# Altium schematic sheet enc28j60.SchDoc: ENC28J60
size A3
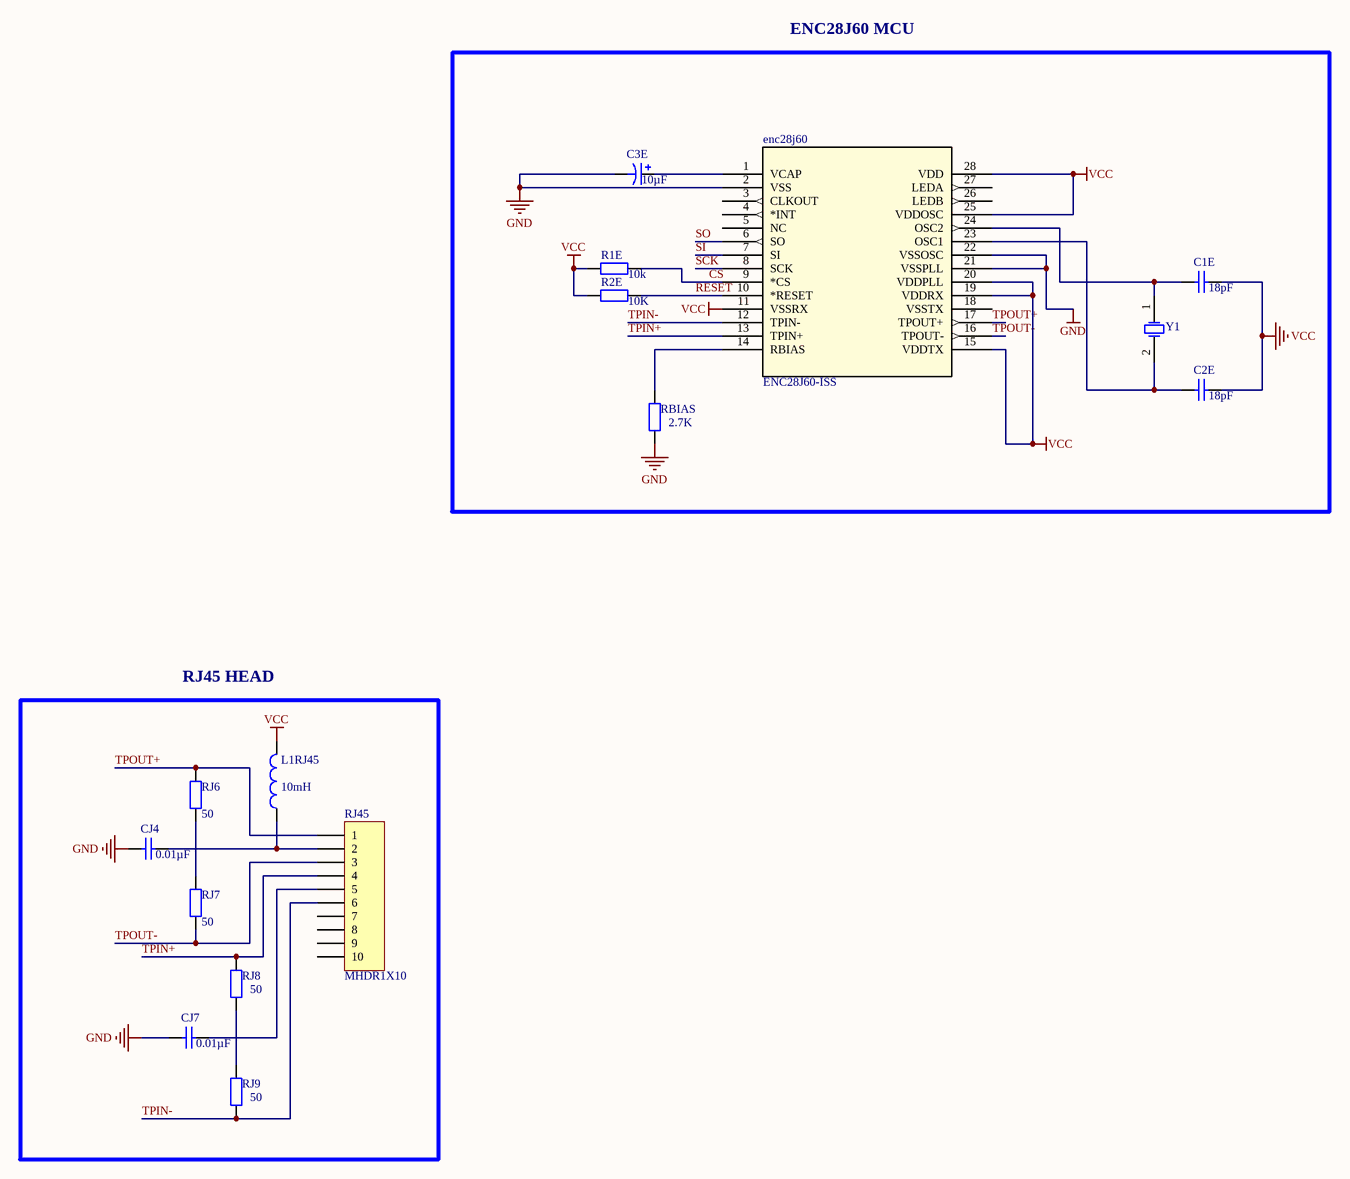
[diagram p0: enc28j60.SchDoc]

## Parts
C1E  value 18pF  [RAD-0.3]  (hidden comment: Cap)
C2E  value 18pF  [RAD-0.3]  (hidden comment: Cap)
C3E  value 10µF  [RB7.6-15]
CJ4  value 0.01µF  [RAD-0.3]  (hidden comment: Cap)
CJ7  value 0.01µF  [RAD-0.3]  (hidden comment: Cap)
enc28j60  ENC28J60-ISS  [SSOP28_MC_MCH]
L1RJ45  value 10mH  [0402-A]  (hidden comment: Inductor)
R1E  value 10k  [AXIAL-0.4]
R2E  value 10K  [AXIAL-0.4]
RBIAS  value 2.7K  [AXIAL-0.4]
RJ6  value 50  [AXIAL-0.4]
RJ7  value 50  [AXIAL-0.4]
RJ8  value 50  [AXIAL-0.4]
RJ9  value 50  [AXIAL-0.4]
RJ45  MHDR1X10  [MHDR1X10]
Y1  XTAL  [R38]  (value not drawn)

## Blocks framed on the sheet
ENC28J60 MCU: C1E C2E C3E enc28j60 R1E R2E RBIAS Y1
RJ45 HEAD: CJ4 CJ7 L1RJ45 RJ6-RJ9 RJ45

## Nets
GND: C3E.2 CJ4.1 CJ7.1 enc28j60.2(VSS) enc28j60.21(VSSPLL) enc28j60.22(VSSOSC) RBIAS.1
VCC: C1E.2 C2E.2 enc28j60.11(VSSRX) enc28j60.15(VDDTX) enc28j60.19(VDDRX) enc28j60.20(VDDPLL) enc28j60.25(VDDOSC) enc28j60.28(VDD) L1RJ45.2 R1E.1 R2E.1
CS: enc28j60.9(*CS) R1E.2
RESET: enc28j60.10(*RESET) R2E.2
SCK: enc28j60.8(SCK)
SI: enc28j60.7(SI)
SO: enc28j60.6(SO)
TPIN+: enc28j60.13(TPIN+) RJ8.2 RJ45.4
TPIN-: enc28j60.12(TPIN-) RJ9.1 RJ45.6
TPOUT+: enc28j60.17(TPOUT+) RJ6.2 RJ45.1
TPOUT-: enc28j60.16(TPOUT-) RJ7.1 RJ45.3
NetC1E_1: C1E.1 enc28j60.24(OSC2) Y1.1(OSC1)
NetC2E_1: C2E.1 enc28j60.23(OSC1) Y1.2(OSC2)
NetC3E_1: C3E.1 enc28j60.1(VCAP)
NetCJ4_2: CJ4.2 L1RJ45.1 RJ45.2
NetCJ7_2: CJ7.2 RJ45.5
Netenc28j60_14: enc28j60.14(RBIAS) RBIAS.2
NetRJ6_1: RJ6.1 RJ7.2
NetRJ8_1: RJ8.1 RJ9.2

Not connected (* = marked no-connect by the designer): enc28j60 3(CLKOUT) 4(*INT) 5(NC) 18(VSSTX) 26(LEDB) 27(LEDA); RJ45 7 8 9 10

## Notes on the sheet
- Title
- Size:
- Date:
- A
- Number:
- Time:
- Revision:
- Sheet
- of
- File:

## Library data of the parts
C1E C2E CJ4 CJ7 = Cap: Capacitor; Published: 8-Jun-2000; LatestRevisionDate: 17-Jul-2002; LatestRevisionNote: Re-released for DXP Platform.; PackageReference: RAD-0.3; Publisher: Altium Limited; PackageDescription: Radial Cap, Thru-Hole; 2 Leads; 0.3 in Pin Spacing
C3E = Cap Pol1: Polarized Capacitor (Radial); Published: 8-Jun-2000; LatestRevisionDate: 17-Jul-2002; LatestRevisionNote: Re-released for DXP Platform.; PackageReference: RB7.6-15; Publisher: Altium Limited; PackageDescription: Polarized Capacitor (Radial); 2 Leads
enc28j60 = ENC28J60-ISS: No Description Available; Mfr_Name: Microchip; RefDes: RefDes; Type: Type
L1RJ45 = Inductor: Code_IEC: 1005; Published: 8-Jun-2000; LatestRevisionDate: 29-May-2009; LatestRevisionNote: IPC-7351 Footprint Added.; PackageReference: 0402-A; Publisher: Altium Limited; PackageDescription: Chip Inductor; Code_JEITA: 0402
R1E R2E RBIAS RJ6-RJ9 = Res2: Resistor; Published: 8-Jun-2000; LatestRevisionDate: 17-Jul-2002; LatestRevisionNote: Re-released for DXP Platform.; PackageReference: AXIAL-0.4; Publisher: Altium Limited; PackageDescription: Axial Device, Thru-Hole; 2 Leads; 0.4 in Pin Spacing
RJ45 = MHDR1X10: Header, 10-Pin; LatestRevisionDate: 17-Jul-2002; LatestRevisionNote: Re-released for DXP Platform.; Publisher: Altium Limited
Y1 = XTAL: Crystal Oscillator; Published: 8-Jun-2000; LatestRevisionDate: 17-Jul-2002; LatestRevisionNote: Re-released for DXP Platform.; PackageReference: R38; Publisher: Altium Limited; PackageDescription: Crystal, Thru-Hole; 2 Leads; Body 3.1 x 8.2 mm (Dia.xH)